# EAGLE design usb64 (EAGLE 9.6.2)
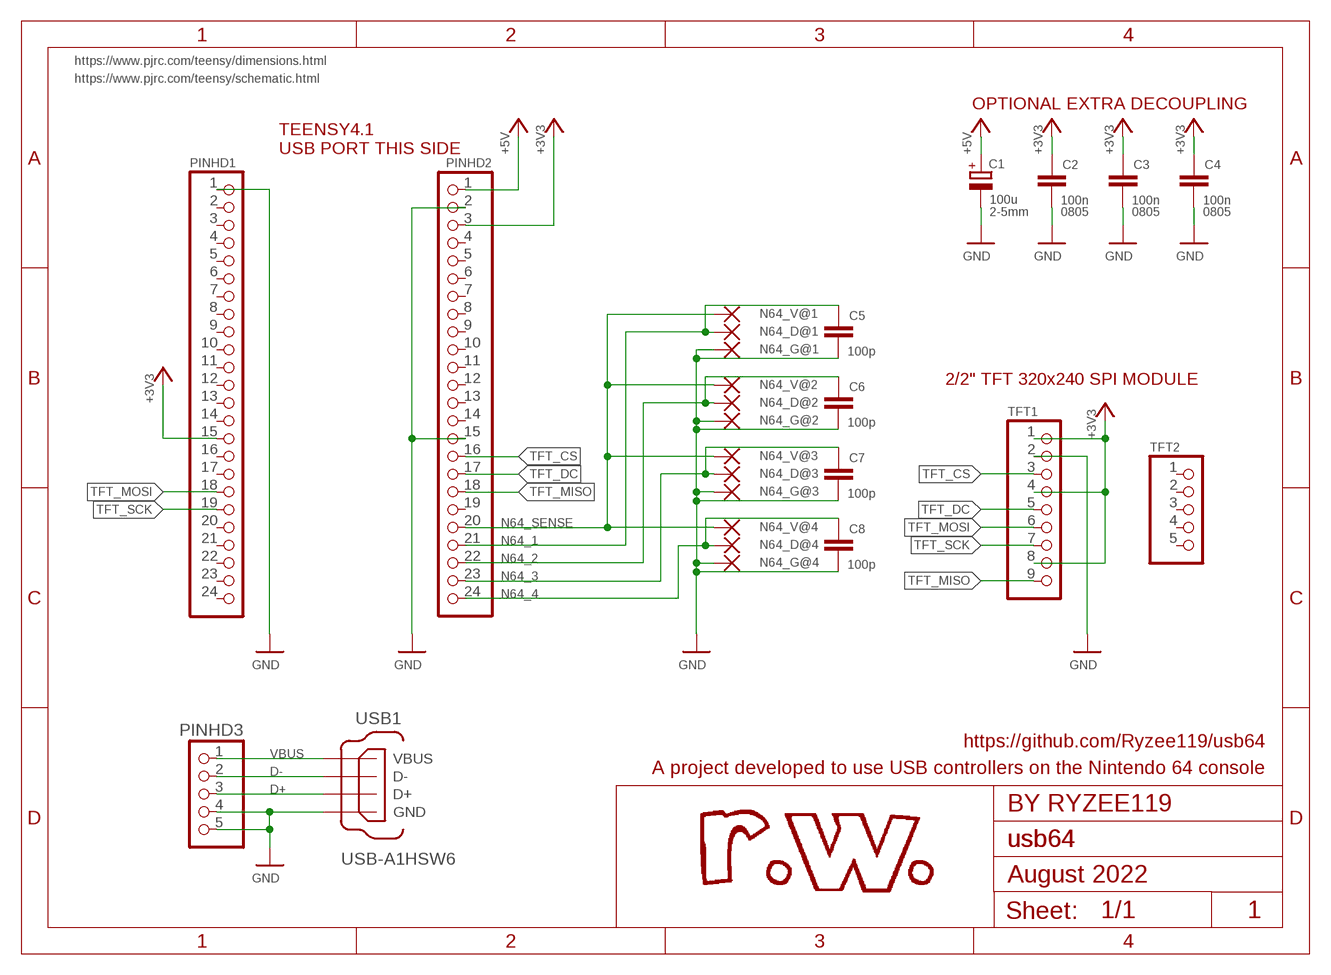
[diagram p0: schematic, sheet 1]

## Parts
C1  100u  CPOL-EUE2-5  [E2-5]
C2  100n  C-EUC0805K  [C0805K]
C3  100n  C-EUC0805K  [C0805K]
C4  100n  C-EUC0805K  [C0805K]
C5  100p  C-EUC0805K  [C0805K]
C6  100p  C-EUC0805K  [C0805K]
C7  100p  C-EUC0805K  [C0805K]
C8  100p  C-EUC0805K  [C0805K]
N64_D@1  SMD2  [SMD1,27-2,54]
N64_D@2  SMD2  [SMD1,27-2,54]
N64_D@3  SMD2  [SMD1,27-2,54]
N64_D@4  SMD2  [SMD1,27-2,54]
N64_G@1  SMD2  [SMD1,27-2,54]
N64_G@2  SMD2  [SMD1,27-2,54]
N64_G@3  SMD2  [SMD1,27-2,54]
N64_G@4  SMD2  [SMD1,27-2,54]
N64_V@1  SMD2  [SMD1,27-2,54]
N64_V@2  SMD2  [SMD1,27-2,54]
N64_V@3  SMD2  [SMD1,27-2,54]
N64_V@4  SMD2  [SMD1,27-2,54]
PINHD1  PINHD-1X24  [1X24]
PINHD2  PINHD-1X24  [1X24]
PINHD3  PINHD-1X5  [1X05]
TFT1  PINHD-1X9  [1X09]
TFT2  PINHD-1X5  [1X05]
USB1  USB-A1HSW6  [OST_USB-A1HSW6]

## Nets
+3V3: C2.1 C3.1 C4.1 PINHD1.15 PINHD2.3 TFT1.1 TFT1.4 TFT1.8
+5V: C1.+ PINHD2.1
D+: PINHD3.3 USB1.3(D+)
D-: PINHD3.2 USB1.2(D-)
GND: C1.- C2.2 C3.2 C4.2 C5.2 C6.2 C7.2 C8.2 N64_G@1.1(P) N64_G@2.1(P) N64_G@3.1(P) N64_G@4.1(P) PINHD1.1 PINHD2.2 PINHD2.15 PINHD3.4 PINHD3.5 TFT1.2 USB1.4(GND)
N64_1: C5.1 N64_D@1.1(P) PINHD2.21
N64_2: C6.1 N64_D@2.1(P) PINHD2.22
N64_3: C7.1 N64_D@3.1(P) PINHD2.23
N64_4: C8.1 N64_D@4.1(P) PINHD2.24
N64_SENSE: N64_V@1.1(P) N64_V@2.1(P) N64_V@3.1(P) N64_V@4.1(P) PINHD2.20
TFT_CS: PINHD2.16 TFT1.3
TFT_DC: PINHD2.17 TFT1.5
TFT_MISO: PINHD2.18 TFT1.9
TFT_MOSI: PINHD1.18 TFT1.6
TFT_SCK: PINHD1.19 TFT1.7
VBUS: PINHD3.1 USB1.1(VBUS)
Unconnected: PINHD1.2 PINHD1.3 PINHD1.4 PINHD1.5 PINHD1.6 PINHD1.7 PINHD1.8 PINHD1.9 PINHD1.10 PINHD1.11 PINHD1.12 PINHD1.13 PINHD1.14 PINHD1.16 PINHD1.17 PINHD1.20 PINHD1.21 PINHD1.22 PINHD1.23 PINHD1.24 PINHD2.4 PINHD2.5 PINHD2.6 PINHD2.7 PINHD2.8 PINHD2.9 PINHD2.10 PINHD2.11 PINHD2.12 PINHD2.13 PINHD2.14 PINHD2.19 TFT2.1 TFT2.2 TFT2.3 TFT2.4 TFT2.5

## Notes on the sheet
- https://www.pjrc.com/teensy/dimensions.html
- https://www.pjrc.com/teensy/schematic.html
- OPTIONAL EXTRA DECOUPLING
- TEENSY4.1
  USB PORT THIS SIDE
- 2-5mm | 0805 | 0805 | 0805
- 2/2" TFT 320x240 SPI MODULE
- https://github.com/Ryzee119/usb64
- A project developed to use USB controllers on the Nintendo 64 console
- BY RYZEE119
- usb64
- August 2022
- 1

## Library data of the parts
C1 = rcl:CPOL-EU: POLARIZED CAPACITOR, European symbol; SPICEPREFIX: C
C2-C8 = rcl:C-EU: CAPACITOR, European symbol; SPICEPREFIX: C
N64_D@1-N64_D@4 N64_G@1-N64_G@4 N64_V@1-N64_V@4 = my-library:SMD2: SMD PAD
PINHD1 PINHD2 = pinhead:PINHD-1X24: PIN HEADER
PINHD3 TFT2 = pinhead:PINHD-1X5: PIN HEADER
TFT1 = pinhead:PINHD-1X9: PIN HEADER
USB1 = my-library:USB-A1HSW6: USB - A Receptacle Connector 4 Position Through Hole, Right Angle; DESCRIPTION: USB-A (USB TYPE-A) Receptacle Connector 4 Position Through Hole, Right Angle; DIGI-KEY_PART_NUMBER: ED2989-ND; MF: On Shore; MP: USB-A1HSW6; PACKAGE: None; PURCHASE-URL: https://pricing.snapeda.com/search/part/USB-A1HSW6/?ref=eda

## Board
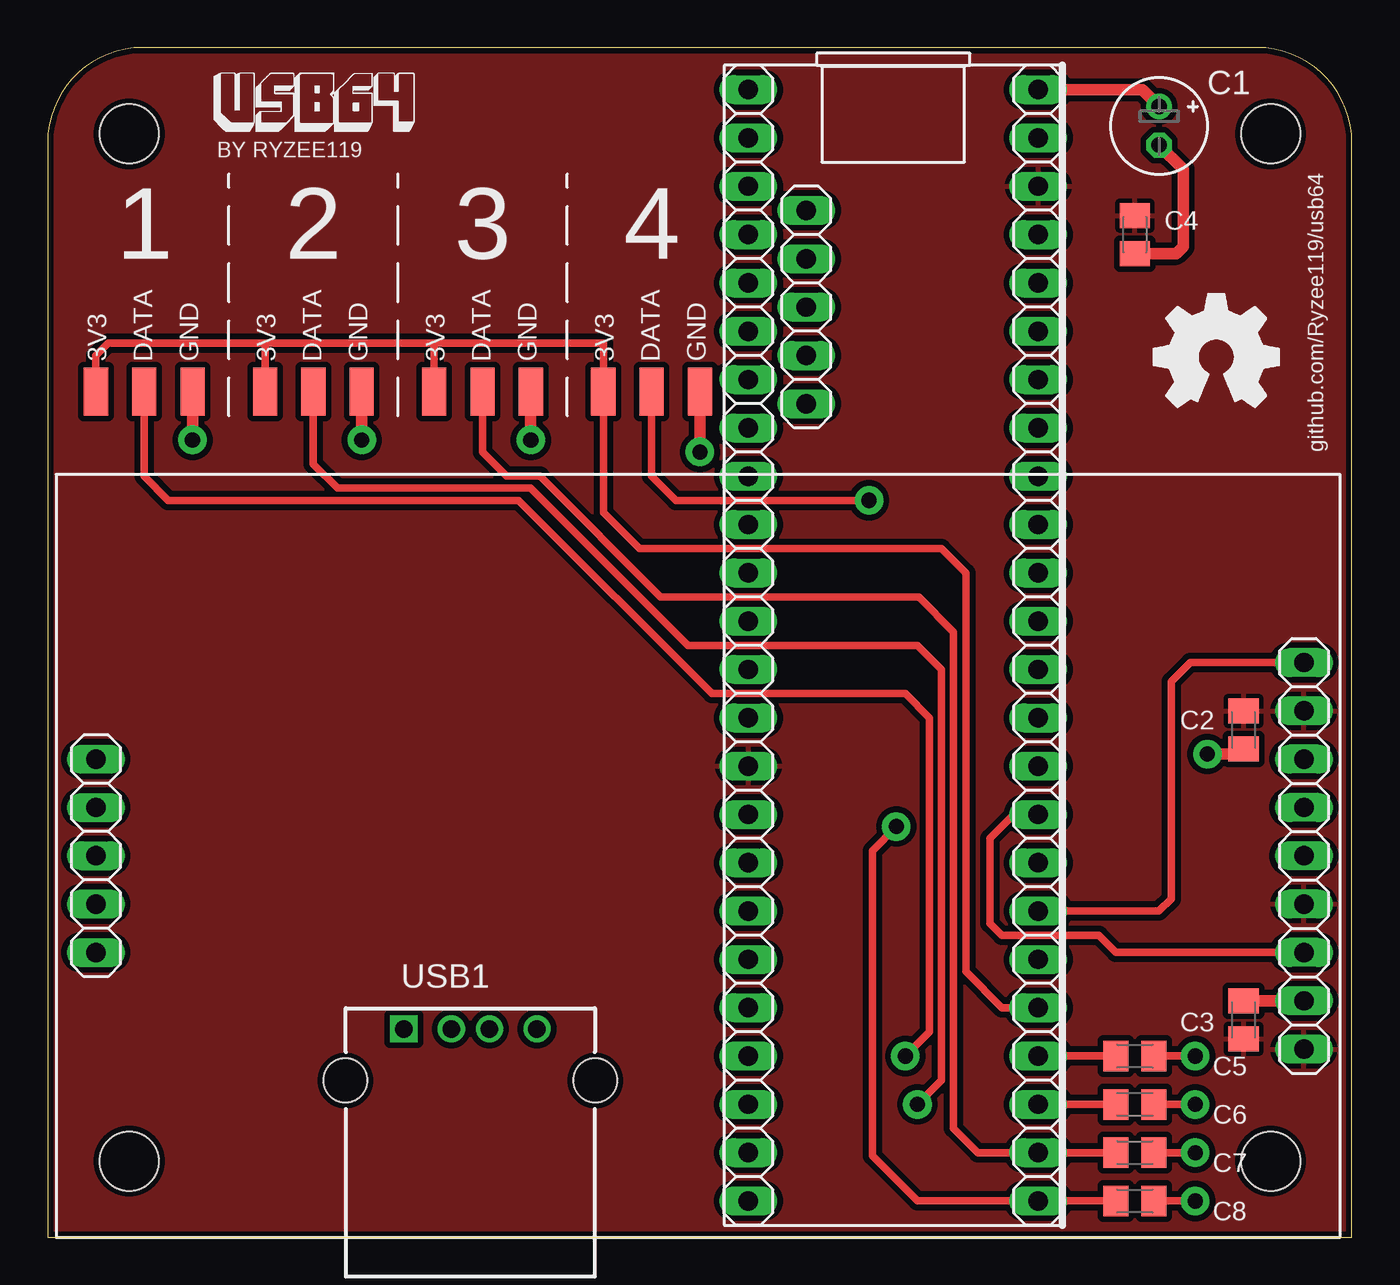
[diagram p1: board, top side]
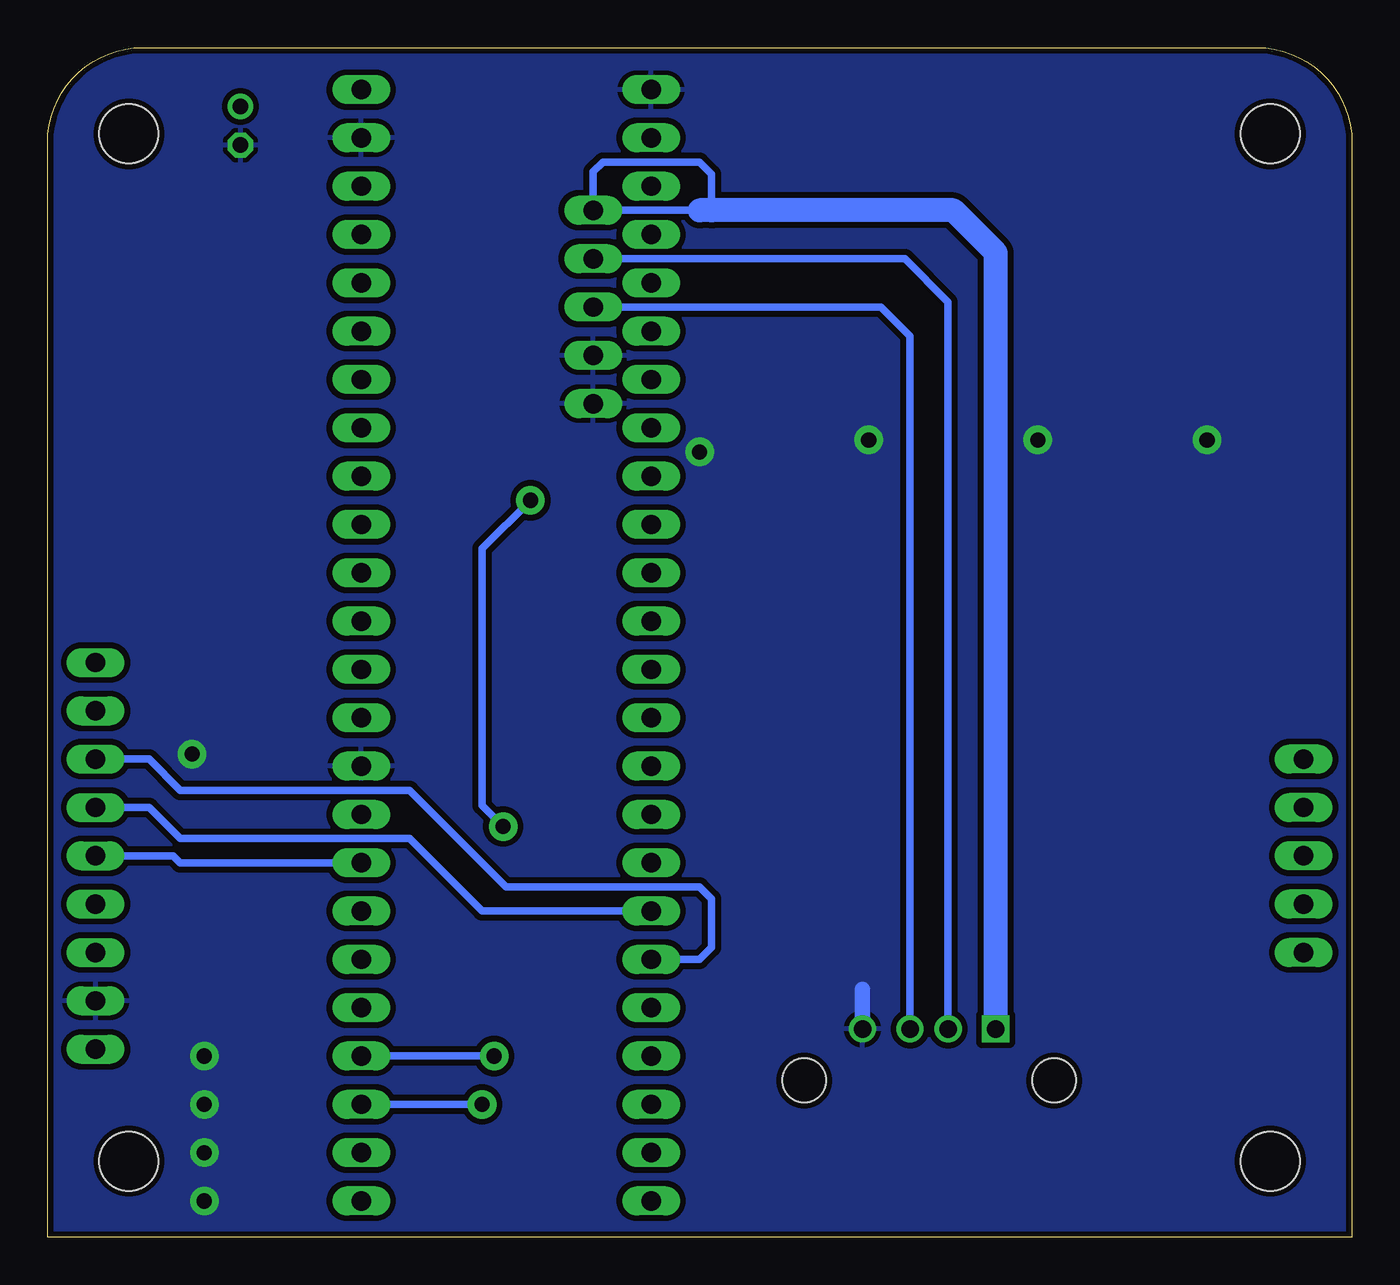
[diagram p2: board, bottom side, seen from below]

Size 68.56 x 62.53 mm. Coordinates in mm from the lower left corner, seen from the top.
Outline: 0,0 68.56,0 68.56,57.53 arc90 63.56,62.53 5,62.53 arc90 0,57.53 0,0
Copper layers (1*16): Top 0.035mm / dielectric 1.5mm / Bottom 0.035mm
Design rules "Elecrow_2-layer_eagle_rule": minimum track width 6mil, minimum drill 12mil, track to track 6mil, track to pad 6mil, pad to pad 6mil, via to via 6mil, smd to smd 0mil, copper to edge 10mil, drill to drill 10mil, minimum pad ring 10mil, minimum via ring 6mil, stop-mask expansion 2mil, vias tented up to drill 100mil, thermal gap 10mil
Holes 3.1 mm at 4.29,4 64.29,4 4.29,58 64.29,58

### Footprints (pad centres in the part's own frame; a part is rotated, then mirrored left to right if it is on the bottom)
E2-5 = drill 0.813 pad 1.27: + -1.016,0 | drill 0.813 pad 1.27 octagon: - 1.016,0
C0805K = smd 1.3 x 1.6: 1 -1,0; 2 1,0
SMD1,27-2,54 = smd 1.27 x 2.54: 1 0,0
1X24 = drill 1.016 long: 1 -29.21,0; 2 -26.67,0; 3 -24.13,0; 4 -21.59,0; 5 -19.05,0; 6 -16.51,0; 7 -13.97,0; 8 -11.43,0; 9 -8.89,0; 10 -6.35,0; 11 -3.81,0; 12 -1.27,0; 13 1.27,0; 14 3.81,0; 15 6.35,0; 16 8.89,0; 17 11.43,0; 18 13.97,0; 19 16.51,0; 20 19.05,0; 21 21.59,0; 22 24.13,0; 23 26.67,0; 24 29.21,0
1X05 = drill 1.016 long: 1 -5.08,0; 2 -2.54,0; 3 0,0; 4 2.54,0; 5 5.08,0
1X09 = drill 1.016 long: 1 -10.16,0; 2 -7.62,0; 3 -5.08,0; 4 -2.54,0; 5 0,0; 6 2.54,0; 7 5.08,0; 8 7.62,0; 9 10.16,0
OST_USB-A1HSW6 = drill 0.92 square: 1 -3.5,6.51 | drill 0.92: 2 -1,6.51; 3 1,6.51; 4 3.5,6.51 | hole 2.3: -6.57,3.8; 6.57,3.8

### Placement (x,y rotation side)
C1  58.42,58.42 270 top
C2  62.87,26.67 270 top
C3  62.87,11.43 90 top
C4  57.15,52.7 270 top
C5  57.15,9.53 0 top
C6  57.15,6.99 0 top
C7  57.15,4.45 0 top
C8  57.15,1.91 0 top
N64_D@1  5.08,44.45 0 top
N64_D@2  13.97,44.45 0 top
N64_D@3  22.86,44.45 0 top
N64_D@4  31.75,44.45 0 top
N64_G@1  7.62,44.45 0 top
N64_G@2  16.51,44.45 0 top
N64_G@3  25.4,44.45 0 top
N64_G@4  34.29,44.45 0 top
N64_V@1  2.54,44.45 0 top
N64_V@2  11.43,44.45 0 top
N64_V@3  20.32,44.45 0 top
N64_V@4  29.21,44.45 0 top
PINHD1  36.83,31.11 270 top
PINHD2  52.07,31.11 270 top
PINHD3  39.88,48.9 270 top
TFT1  66.04,20.05 90 top
TFT2  2.54,20.05 270 top
USB1  22.23,4.45 0 top

### Tracks (layer width: path | path; a pad name or v marks a point on that pad's centre or on a via)
+3V3
  pour Top (isolate 0.305): -3.81,69.85 -3.81,-1.27 72.39,-1.27 72.39,69.85
+5V
  Top 0.61: PINHD2.1 57.53,60.33 C1.+
D+
  Bottom 0.406: USB1.3 23.23,47.35 24.77,48.9 PINHD3.3
D-
  Bottom 0.406: USB1.2 21.23,49.16 23.5,51.44 PINHD3.2
GND  (via drill 0.8 pad 1.5)
  Top 0.406: C5.2 v60.33,9.53 | C6.2 v60.33,6.99 | C7.2 v60.33,4.45 | C8.2 v60.33,1.91
  Top 0.61: N64_G@1.1 v7.62,41.91 | N64_G@2.1 v16.51,41.91 | N64_G@3.1 v25.4,41.91 | N64_G@4.1 v34.29,41.27 | C4.2 59.33,51.7 59.69,52.07 59.69,56.13 C1.- | C3.2 TFT1.2 | C2.2 62.59,25.4 v60.96,25.4
  Bottom 0.813: USB1.4 25.73,13.03
  pour Bottom (isolate 0.305): -3.81,72.39 -3.81,-3.81 78.74,-3.81 78.74,72.39
N64_1  (via drill 0.8 pad 1.5)
  Top 0.406: N64_D@1.1 5.08,40.01 6.35,38.73 24.77,38.73 34.92,28.57 45.09,28.57 46.35,27.3 46.35,10.79 v45.09,9.53 | C5.1 PINHD2.21
  Bottom 0.406: v45.09,9.53 PINHD2.21
N64_2  (via drill 0.8 pad 1.5)
  Top 0.406: N64_D@2.1 13.97,40.64 15.24,39.37 25.4,39.37 33.66,31.11 45.72,31.11 46.99,29.84 46.99,8.26 v45.72,6.99 | PINHD2.22 C6.1
  Bottom 0.406: v45.72,6.99 PINHD2.22
N64_3
  Top 0.406: N64_D@3.1 22.86,41.27 24.13,40.01 25.88,40.01 32.23,33.66 45.8,33.66 47.62,31.83 47.62,5.71 48.9,4.45 PINHD2.23 C7.1
N64_4  (via drill 0.8 pad 1.5)
  Top 0.406: N64_D@4.1 31.75,40.01 33.02,38.73 v43.18,38.73 | v44.61,21.59 43.34,20.32 43.34,4.28 45.72,1.91 PINHD2.24 C8.1
  Bottom 0.406: v43.18,38.73 45.72,36.2 45.72,22.7 v44.61,21.59
N64_SENSE
  Top 0.406: PINHD2.20 50.16,12.06 48.26,13.97 48.26,34.92 46.99,36.2 31.11,36.2 29.21,38.1 N64_V@4.1 29.21,46.99 20.32,46.99 | N64_V@1.1 2.54,46.35 3.17,46.99 11.43,46.99 | 11.43,46.99 20.32,46.99 | N64_V@2.1 11.43,46.99 | N64_V@3.1 20.32,46.99
TFT_CS
  Top 0.406: TFT1.3 56.15,14.97 55.24,15.88 50.16,15.88 49.53,16.51 49.53,20.95 50.8,22.23 PINHD2.16
TFT_DC
  Bottom 0.406: PINHD2.17 58.42,19.68 61.59,19.68 61.96,20.05 TFT1.5
TFT_MISO
  Top 0.406: TFT1.9 60.05,30.21 59.05,29.21 59.05,17.78 58.42,17.14 PINHD2.18
TFT_MOSI
  Bottom 0.406: PINHD1.18 45.72,17.14 49.53,20.95 61.59,20.95 63.23,22.59 TFT1.6
TFT_SCK
  Bottom 0.406: PINHD1.19 34.29,14.61 33.66,15.24 33.66,17.78 34.29,18.41 44.45,18.41 49.53,23.5 61.59,23.5 63.23,25.13 TFT1.7
VBUS
  Bottom 0.406: 34.29,53.98 PINHD3.1 39.88,56.01 39.37,56.52 34.29,56.52 33.66,55.88 33.66,53.98
  Bottom 1.27: 34.29,53.98 33.66,53.98 20.95,53.98 18.73,51.74 USB1.1

### Text on the board
tPlace: BY RYZEE119 | 1 | 2 | 3 | 4 | 3V3 / DATA / GND | 3V3 / DATA / GND | 3V3 / DATA / GND | 3V3 / DATA / GND | github.com/Ryzee119/usb64